# Altium schematic sheet Sheet1.SchDoc
size A4; SheetNumber: 1; SheetTotal: 1
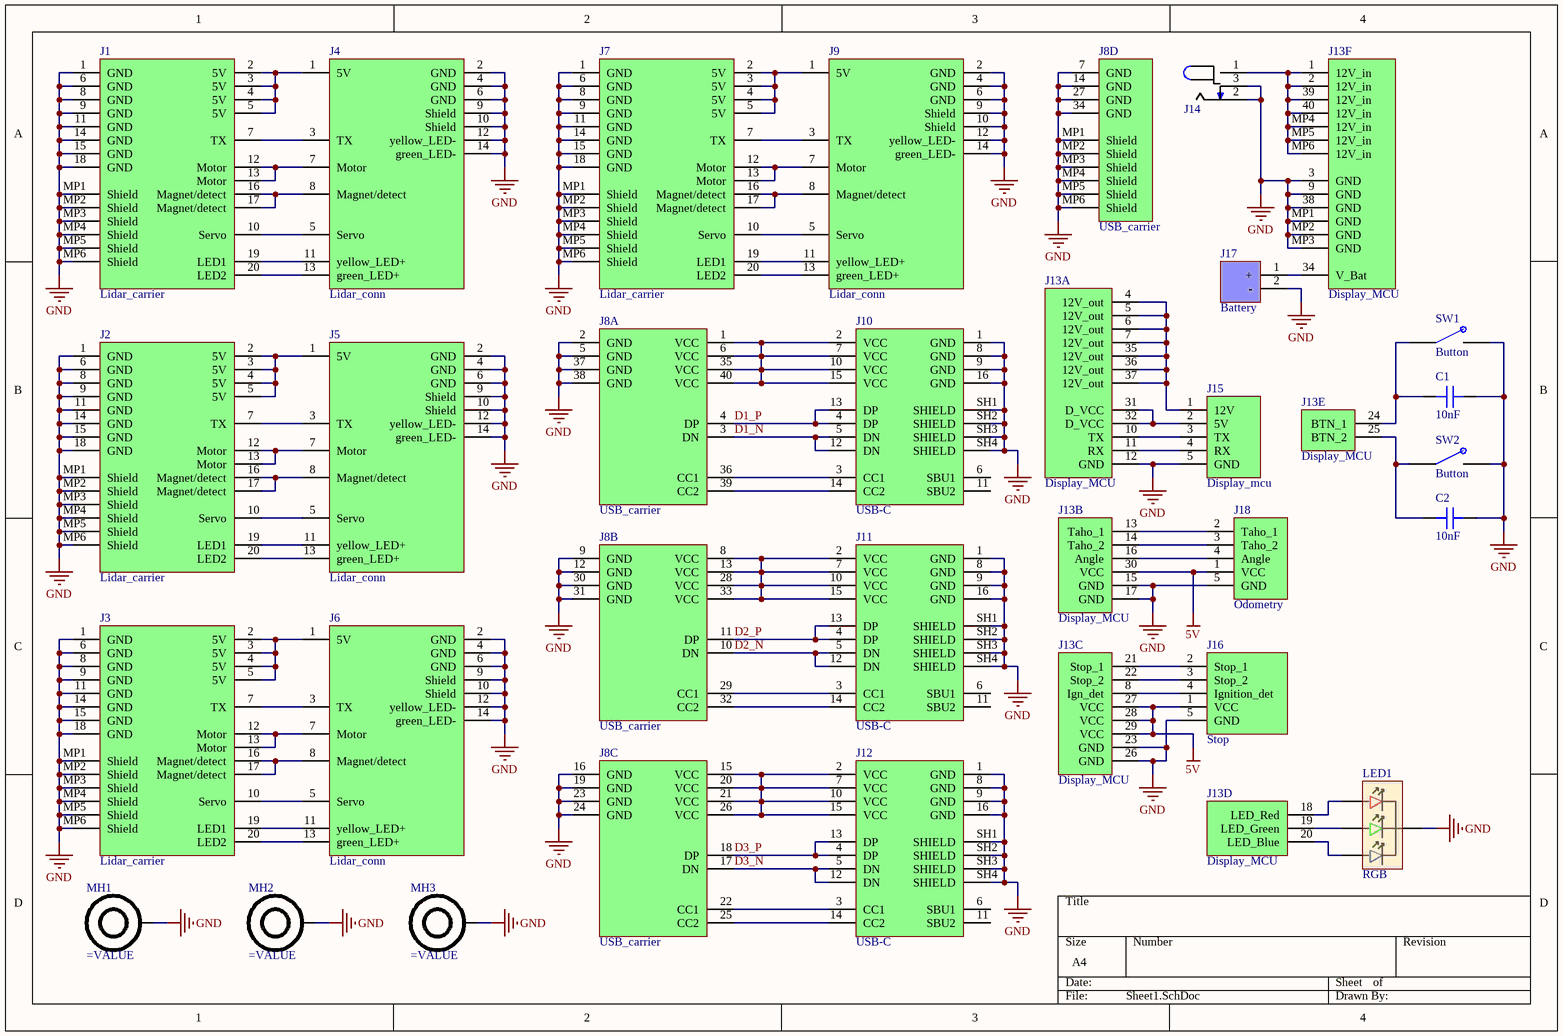
[diagram p0: Sheet1.SchDoc]

## Parts
C1  10nF  [CAP 0603]
C2  10nF  [CAP 0603]
J1  Lidar_carrier  [2167000209]
J2  Lidar_carrier  [2167000209]
J3  Lidar_carrier  [2167000209]
J4  Lidar_conn  [MTJ88ARX1FSMLG]
J5  Lidar_conn  [MTJ88ARX1FSMLG]
J6  Lidar_conn  [MTJ88ARX1FSMLG]
J7  Lidar_carrier  [2167000209]
J8  USB_carrier  [2167000409]  (parts A,B,C,D of 4)
J9  Lidar_conn  [MTJ88ARX1FSMLG]
J10  USB-C  [AMPHENOL_GSB1C211110DS1HR]
J11  USB-C  [AMPHENOL_GSB1C211110DS1HR]
J12  USB-C  [AMPHENOL_GSB1C211110DS1HR]
J13  Display_MCU  [2167000409]  (parts A,B,C,D,E,F of 6)
J14  Power Jack  [Power_Jack]  (value not drawn)
J15  Display_mcu  [SHDRRA5W64P0X250_1X5_1490X1150X610P]
J16  Stop  [SHDRRA5W64P0X250_1X5_1490X1150X610P]
J17  Battery  [BAT_BH-25C-1]
J18  Odometry  [SHDRRA5W64P0X250_1X5_1490X1150X610P]
LED1  RGB  [LED_QBL8RGB60D0-2897]
MH1  (no value)  [SCREW_M3.0]
MH2  (no value)  [SCREW_M3.0]
MH3  (no value)  [SCREW_M3.0]
SW1  Button  [COM10302]
SW2  Button  [COM10302]

## Nets
5V: J13.27(VCC) J13.28(VCC) J13.29(VCC) J13.30(VCC) J16.1(VCC) J18.1(VCC)
GND: C1.2 C2.2 J1.1(GND) J1.6(GND) J1.8(GND) J1.9(GND) J1.11(GND) J1.14(GND) J1.15(GND) J1.18(GND) J1.MP1(Shield) J1.MP2(Shield) J1.MP3(Shield) J1.MP4(Shield) J1.MP5(Shield) J1.MP6(Shield) J2.1(GND) J2.6(GND) J2.8(GND) J2.9(GND) J2.11(GND) J2.14(GND) J2.15(GND) J2.18(GND) J2.MP1(Shield) J2.MP2(Shield) J2.MP3(Shield) J2.MP4(Shield) J2.MP5(Shield) J2.MP6(Shield) J3.1(GND) J3.6(GND) J3.8(GND) J3.9(GND) J3.11(GND) J3.14(GND) J3.15(GND) J3.18(GND) J3.MP1(Shield) J3.MP2(Shield) J3.MP3(Shield) J3.MP4(Shield) J3.MP5(Shield) J3.MP6(Shield) J4.2(GND) J4.4(GND) J4.6(GND) J4.9(Shield) J4.10(Shield) J4.12(yellow_LED-) J4.14(green_LED-) J5.2(GND) J5.4(GND) J5.6(GND) J5.9(Shield) J5.10(Shield) J5.12(yellow_LED-) J5.14(green_LED-) J6.2(GND) J6.4(GND) J6.6(GND) J6.9(Shield) J6.10(Shield) J6.12(yellow_LED-) J6.14(green_LED-) J7.1(GND) J7.6(GND) J7.8(GND) J7.9(GND) J7.11(GND) J7.14(GND) J7.15(GND) J7.18(GND) J7.MP1(Shield) J7.MP2(Shield) J7.MP3(Shield) J7.MP4(Shield) J7.MP5(Shield) J7.MP6(Shield) J8.2(GND) J8.5(GND) J8.7(GND) J8.9(GND) J8.12(GND) J8.14(GND) J8.16(GND) J8.19(GND) J8.23(GND) J8.24(GND) J8.27(GND) J8.30(GND) J8.31(GND) J8.34(GND) J8.37(GND) J8.38(GND) J8.MP1(Shield) J8.MP2(Shield) J8.MP3(Shield) J8.MP4(Shield) J8.MP5(Shield) J8.MP6(Shield) J9.2(GND) J9.4(GND) J9.6(GND) J9.9(Shield) J9.10(Shield) J9.12(yellow_LED-) J9.14(green_LED-) J10.1(GND) J10.8(GND) J10.9(GND) J10.16(GND) J10.SH1(SHIELD) J10.SH2(SHIELD) J10.SH3(SHIELD) J10.SH4(SHIELD) J11.1(GND) J11.8(GND) J11.9(GND) J11.16(GND) J11.SH1(SHIELD) J11.SH2(SHIELD) J11.SH3(SHIELD) J11.SH4(SHIELD) J12.1(GND) J12.8(GND) J12.9(GND) J12.16(GND) J12.SH1(SHIELD) J12.SH2(SHIELD) J12.SH3(SHIELD) J12.SH4(SHIELD) J13.3(GND) J13.9(GND) J13.12(GND) J13.15(GND) J13.17(GND) J13.23(GND) J13.26(GND) J13.38(GND) J13.MP1(GND) J13.MP2(GND) J13.MP3(GND) J14.2 J14.3 J15.5(GND) J16.5(GND) J17.2(-) J18.5(GND) LED1.2(Catode) MH1.1 MH2.1 MH3.1 SW1.2 SW2.2
D1_N: J8.3(DN) J10.5(DN) J10.12(DN)
D1_P: J8.4(DP) J10.4(DP) J10.13(DP)
D2_N: J8.10(DN) J11.5(DN) J11.12(DN)
D2_P: J8.11(DP) J11.4(DP) J11.13(DP)
D3_N: J8.17(DN) J12.5(DN) J12.12(DN)
D3_P: J8.18(DP) J12.4(DP) J12.13(DP)
NetC1_1: C1.1 J13.24(BTN_1) SW1.1
NetC2_1: C2.1 J13.25(BTN_2) SW2.1
NetJ1_2: J1.2(5V) J1.3(5V) J1.4(5V) J1.5(5V) J4.1(5V)
NetJ1_7: J1.7(TX) J4.3(TX)
NetJ1_10: J1.10(Servo) J4.5(Servo)
NetJ1_12: J1.12(Motor) J1.13(Motor) J4.7(Motor)
NetJ1_16: J1.16(Magnet/detect) J1.17(Magnet/detect) J4.8(Magnet/detect)
NetJ1_19: J1.19(LED1) J4.11(yellow_LED+)
NetJ1_20: J1.20(LED2) J4.13(green_LED+)
NetJ2_2: J2.2(5V) J2.3(5V) J2.4(5V) J2.5(5V) J5.1(5V)
NetJ2_7: J2.7(TX) J5.3(TX)
NetJ2_10: J2.10(Servo) J5.5(Servo)
NetJ2_12: J2.12(Motor) J2.13(Motor) J5.7(Motor)
NetJ2_16: J2.16(Magnet/detect) J2.17(Magnet/detect) J5.8(Magnet/detect)
NetJ2_19: J2.19(LED1) J5.11(yellow_LED+)
NetJ2_20: J2.20(LED2) J5.13(green_LED+)
NetJ3_2: J3.2(5V) J3.3(5V) J3.4(5V) J3.5(5V) J6.1(5V)
NetJ3_7: J3.7(TX) J6.3(TX)
NetJ3_10: J3.10(Servo) J6.5(Servo)
NetJ3_12: J3.12(Motor) J3.13(Motor) J6.7(Motor)
NetJ3_16: J3.16(Magnet/detect) J3.17(Magnet/detect) J6.8(Magnet/detect)
NetJ3_19: J3.19(LED1) J6.11(yellow_LED+)
NetJ3_20: J3.20(LED2) J6.13(green_LED+)
NetJ7_2: J7.2(5V) J7.3(5V) J7.4(5V) J7.5(5V) J9.1(5V)
NetJ7_7: J7.7(TX) J9.3(TX)
NetJ7_10: J7.10(Servo) J9.5(Servo)
NetJ7_12: J7.12(Motor) J7.13(Motor) J9.7(Motor)
NetJ7_16: J7.16(Magnet/detect) J7.17(Magnet/detect) J9.8(Magnet/detect)
NetJ7_19: J7.19(LED1) J9.11(yellow_LED+)
NetJ7_20: J7.20(LED2) J9.13(green_LED+)
NetJ8_1: J8.1(VCC) J8.6(VCC) J8.35(VCC) J8.40(VCC) J10.2(VCC) J10.7(VCC) J10.10(VCC) J10.15(VCC)
NetJ8_8: J8.8(VCC) J8.13(VCC) J8.28(VCC) J8.33(VCC) J11.2(VCC) J11.7(VCC) J11.10(VCC) J11.15(VCC)
NetJ8_15: J8.15(VCC) J8.20(VCC) J8.21(VCC) J8.26(VCC) J12.2(VCC) J12.7(VCC) J12.10(VCC) J12.15(VCC)
NetJ8_22: J8.22(CC1) J12.3(CC1)
NetJ8_25: J8.25(CC2) J12.14(CC2)
NetJ8_29: J8.29(CC1) J11.3(CC1)
NetJ8_32: J8.32(CC2) J11.14(CC2)
NetJ8_36: J8.36(CC1) J10.3(CC1)
NetJ8_39: J8.39(CC2) J10.14(CC2)
NetJ13_1: J13.1(12V_in) J13.2(12V_in) J13.39(12V_in) J13.40(12V_in) J13.MP4(12V_in) J13.MP5(12V_in) J13.MP6(12V_in) J14.1
NetJ13_4: J13.4(12V_out) J13.5(12V_out) J13.6(12V_out) J13.7(12V_out) J13.35(12V_out) J13.36(12V_out) J13.37(12V_out) J15.1(12V)
NetJ13_8: J13.8(Ign_det) J16.4(Ignition_det)
NetJ13_10: J13.10(TX) J15.3(TX)
NetJ13_11: J13.11(RX) J15.4(RX)
NetJ13_13: J13.13(Taho_1) J18.2(Taho_1)
NetJ13_14: J13.14(Taho_2) J18.3(Taho_2)
NetJ13_16: J13.16(Angle) J18.4(Angle)
NetJ13_18: J13.18(LED_Red) LED1.1(R)
NetJ13_19: J13.19(LED_Green) LED1.3(G)
NetJ13_20: J13.20(LED_Blue) LED1.4(B)
NetJ13_21: J13.21(Stop_1) J16.2(Stop_1)
NetJ13_22: J13.22(Stop_2) J16.3(Stop_2)
NetJ13_31: J13.31(D_VCC) J13.32(D_VCC) J15.2(5V)
NetJ13_34: J13.34(V_Bat) J17.1(+)

Not connected (* = marked no-connect by the designer): J10 6(SBU1) 11(SBU2); J11 6(SBU1) 11(SBU2); J12 6(SBU1) 11(SBU2)

## Library data of the parts
C1 C2 = Capacitor: SMT Capacitor; Value: 10nF
J13 = AUX_carrier
J14 = P_Power Jack: Power Barrel Connector Jack 2.10mm ID (0.083"), 5.50mm OD (0.217") Through Hole, Right Angle; MFR Part #: PJ-102A; Value: CONN PWR JACK 2X5.5MM SOLDER; Digikey Link: https://www.digikey.com/product-detail/en/PJ-102A/CP-102A-ND/275425/?itemSeq=304982367; LCSC Part#: C136744; Type: Extended
J15 = Display_connector
J16 = Stop_connector
J18 = Odomery_connector
LED1 = RGB_LED: MFR Part #: NCD1206B1; Type: Extended; LCSC Part#: C130717; Datasheet: https://datasheet.lcsc.com/lcsc/2008201033_Foshan-NationStar-Optoelectronics-NCD1206B1_C130717.pdf
MH1-MH3 = SCREW
SW1 SW2 = Button: pin to pad: 2>3